# Altium schematic sheet LedRYG.SchDoc
size A4
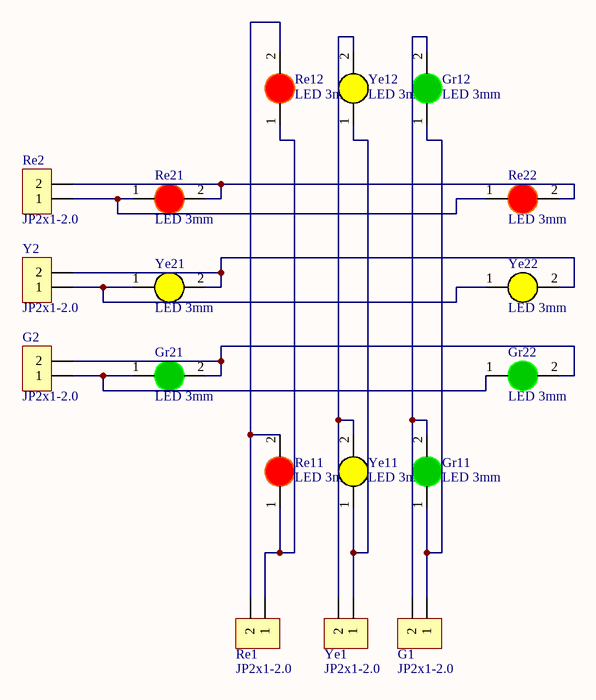
[diagram p0: LedRYG.SchDoc]

## Parts
G1  JP2x1-2.0  [J2-C1T]
G2  JP2x1-2.0  [J2-C1T]
Gr11  LED 3mm  [LED-3MM-GREEN]
Gr12  LED 3mm  [LED-3MM-GREEN]
Gr21  LED 3mm  [LED-3MM-GREEN]
Gr22  LED 3mm  [LED-3MM-GREEN]
Re1  JP2x1-2.0  [J2-C1T]
Re2  JP2x1-2.0  [J2-C1T]
Re11  LED 3mm  [LED-3MM-RED]
Re12  LED 3mm  [LED-3MM-RED]
Re21  LED 3mm  [LED-3MM-RED]
Re22  LED 3mm  [LED-3MM-RED]
Y2  JP2x1-2.0  [J2-C1T]
Ye1  JP2x1-2.0  [J2-C1T]
Ye11  LED 3mm  [LED-3MM-YELLOW]
Ye12  LED 3mm  [LED-3MM-YELLOW]
Ye21  LED 3mm  [LED-3MM-YELLOW]
Ye22  LED 3mm  [LED-3MM-YELLOW]

## Nets
NetG1_1: G1.1 Gr11.1(A) Gr12.1(A)
NetG1_2: G1.2 Gr11.2(K) Gr12.2(K)
NetG2_1: G2.1 Gr21.1(A) Gr22.1(A)
NetG2_2: G2.2 Gr21.2(K) Gr22.2(K)
NetRe1_1: Re1.1 Re11.1(A) Re12.1(A)
NetRe1_2: Re1.2 Re11.2(K) Re12.2(K)
NetRe2_1: Re2.1 Re21.1(A) Re22.1(A)
NetRe2_2: Re2.2 Re21.2(K) Re22.2(K)
NetY2_1: Y2.1 Ye21.1(A) Ye22.1(A)
NetY2_2: Y2.2 Ye21.2(K) Ye22.2(K)
NetYe1_1: Ye1.1 Ye11.1(A) Ye12.1(A)
NetYe1_2: Ye1.2 Ye11.2(K) Ye12.2(K)

## Library data of the parts
G1 G2 Re1 Re2 Y2 Ye1 = JP2x1-2.0: WR-PHD 2.00 mm Socket Header; Manufacturer: W¨¹rth Elektronik eiSos GmbH; partNo: 62000211821; ComponentLink1 Description: Manufacturer; ComponentLink2 Description: Datasheet; NoPins: 02; Created Date: 2 April 2013; ComponentLink1URL: http://www.we-online.com; ComponentLink2URL: http://katalog.we-online.de/em/datasheet/6200xx11821.pdf; Created by: Karrer Zheng
Gr11 Gr12 Gr21 Gr22 = LED 3mm Xanh La: Cắm; Don_Vi: Con; Ma_Hang: MH001054; Ten_Linh_Kien: Led 3MM Phủ Xanh (10c); Ghi_Chu: *; Kieu_Chan: *; Chung_Loai: Cắm
Re11 Re12 Re21 Re22 = LED 3mm Do: Cắm; Don_Vi: Con; Ma_Hang: MH003892; Ten_Linh_Kien: Led 3MM Phủ Đỏ (10c); Ghi_Chu: *; Kieu_Chan: *; Chung_Loai: Cắm
Ye11 Ye12 Ye21 Ye22 = LED 3mm Vang: Cắm; Don_Vi: Con; Ma_Hang: MH003893; Ten_Linh_Kien: Led 3MM Phủ Vàng (10c); Ghi_Chu: *; Kieu_Chan: *; Chung_Loai: Cắm